# EAGLE design Phoenix_FC_shield (EAGLE 6.4)
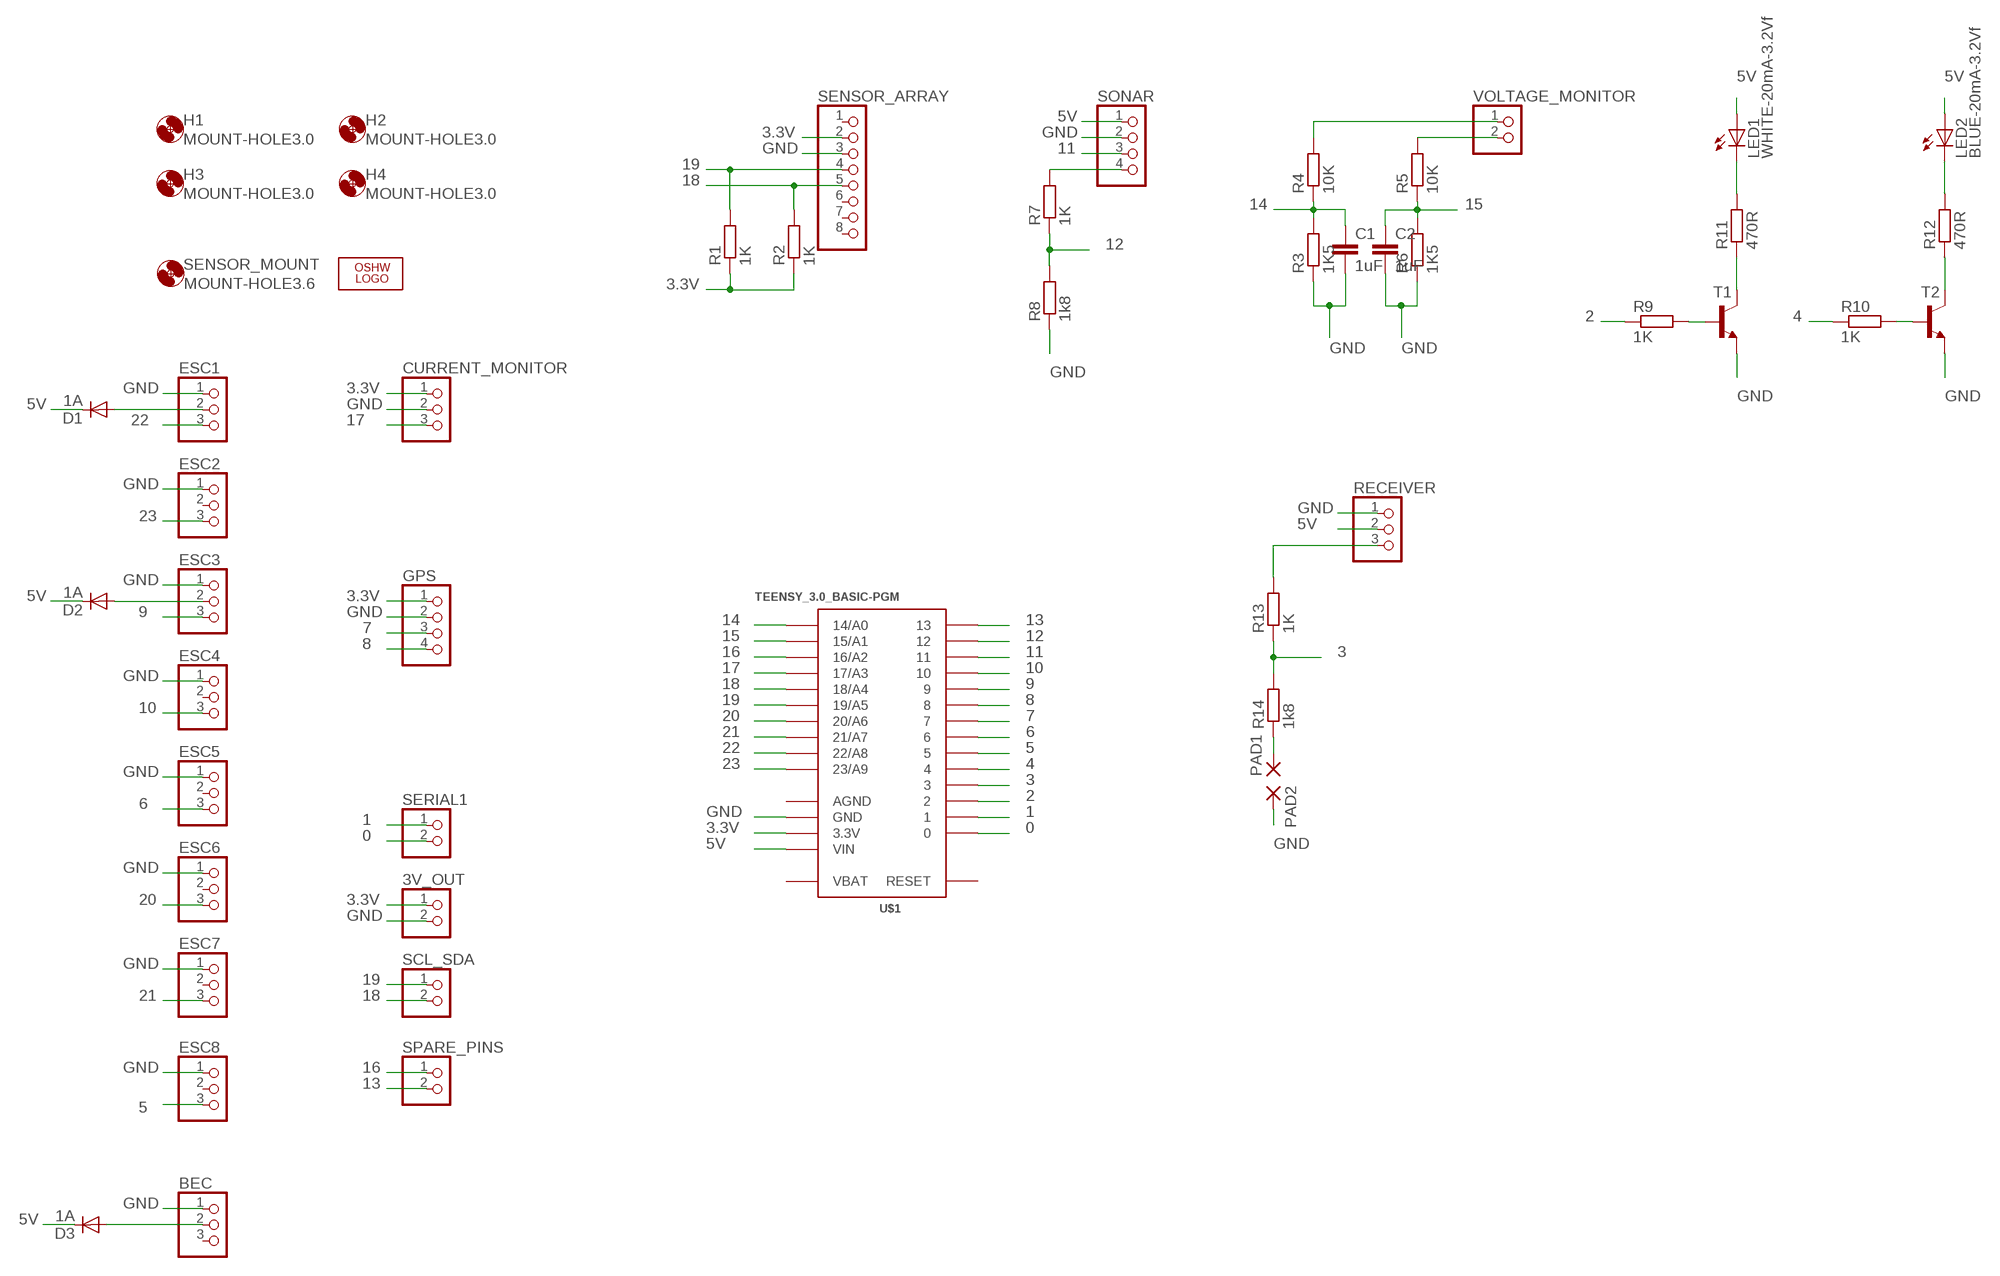
[diagram p0: schematic, sheet 1]

## Parts
3V_OUT  PINHD-1X2  [1X02]
BEC  PINHD-1X3  [1X03]
C1  1uF  C-EUC0805  [C0805]
C2  1uF  C-EUC0805  [C0805]
CURRENT_MONITOR  PINHD-1X3  [1X03]
D1  1A  DIODE-DO-214AC  [DO-214AC]
D2  1A  DIODE-DO-214AC  [DO-214AC]
D3  1A  DIODE-DO-214AC  [DO-214AC]
ESC1  PINHD-1X3  [1X03]
ESC2  PINHD-1X3  [1X03]
ESC3  PINHD-1X3  [1X03]
ESC4  PINHD-1X3  [1X03]
ESC5  PINHD-1X3  [1X03]
ESC6  PINHD-1X3  [1X03]
ESC7  PINHD-1X3  [1X03]
ESC8  PINHD-1X3  [1X03]
GPS  PINHD-1X4  [1X04]
H1  MOUNT-HOLE3.0  [3,0]
H2  MOUNT-HOLE3.0  [3,0]
H3  MOUNT-HOLE3.0  [3,0]
H4  MOUNT-HOLE3.0  [3,0]
LED1  WHITE-20mA-3.2Vf  LEDCHIP-LED0805  [CHIP-LED0805]
LED2  BLUE-20mA-3.2Vf  LEDCHIP-LED0805  [CHIP-LED0805]
LOGO1  OSHW_LOGO_8MILX0200-NT  [OSHW_8X200_NOTEXT]
PAD1  WIREPADSMD1,27-254  [SMD1,27-2,54]
PAD2  WIREPADSMD1,27-254  [SMD1,27-2,54]
R1  1K  R-EU_R0805  [R0805]
R2  1K  R-EU_R0805  [R0805]
R3  1K5  R-EU_R0805  [R0805]
R4  10K  R-EU_R0805  [R0805]
R5  10K  R-EU_R0805  [R0805]
R6  1K5  R-EU_R0805  [R0805]
R7  1K  R-EU_R0805  [R0805]
R8  1k8  R-EU_R0805  [R0805]
R9  1K  R-EU_R0805  [R0805]
R10  1K  R-EU_R0805  [R0805]
R11  470R  R-EU_R0805  [R0805]
R12  470R  R-EU_R0805  [R0805]
R13  1K  R-EU_R0805  [R0805]
R14  1k8  R-EU_R0805  [R0805]
RECEIVER  PINHD-1X3  [1X03]
SCL_SDA  PINHD-1X2  [1X02]
SENSOR_ARRAY  PINHD-1X8  [1X08]
SENSOR_MOUNT  MOUNT-HOLE3.6  [3,6]
SERIAL1  PINHD-1X2  [1X02]
SONAR  PINHD-1X4  [1X04]
SPARE_PINS  PINHD-1X2  [1X02]
T1  BC817-40SMD  [SOT23-BEC]
T2  BC817-40SMD  [SOT23-BEC]
U$1  TEENSY_3.0_BASIC-PGM  [TEENSY_3.0_BASIC-PGM]
VOLTAGE_MONITOR  PINHD-1X2  [1X02]

## Nets
0: SERIAL1.2 U$1.0
1: SERIAL1.1 U$1.1
2: R9.1 U$1.2
3: R13.1 R14.2 U$1.3
3.3V: 3V_OUT.1 CURRENT_MONITOR.1 GPS.1 R1.1 R2.1 SENSOR_ARRAY.2 U$1.3.3V U$1.3.3V1(3.3V)
4: R10.1 U$1.4
5: ESC8.3 U$1.5
5V: D1.C D2.C D3.C LED1.A LED2.A RECEIVER.2 SONAR.1 U$1.VIN
6: ESC5.3 U$1.6
7: GPS.3 U$1.7
8: GPS.4 U$1.8
9: ESC3.3 U$1.9
10: ESC4.3 U$1.10
11: SONAR.3 U$1.11
12: R7.1 R8.2 U$1.12
13: SPARE_PINS.2 U$1.13
14: C1.1 R3.2 R4.1 U$1.14/A0
15: C2.1 R5.1 R6.2 U$1.15/A1
16: SPARE_PINS.1 U$1.16/A2
17: CURRENT_MONITOR.3 U$1.17/A3
18: R2.2 SCL_SDA.2 SENSOR_ARRAY.5 U$1.18/A4
19: R1.2 SCL_SDA.1 SENSOR_ARRAY.4 U$1.19/A5
20: ESC6.3 U$1.20/A6
21: ESC7.3 U$1.21/A7
22: ESC1.3 U$1.22/A8
23: ESC2.3 U$1.23/A9
GND: 3V_OUT.2 BEC.1 C1.2 C2.2 CURRENT_MONITOR.2 ESC1.1 ESC2.1 ESC3.1 ESC4.1 ESC5.1 ESC6.1 ESC7.1 ESC8.1 GPS.2 PAD2.1(P) R3.1 R6.1 R8.1 RECEIVER.1 SENSOR_ARRAY.3 SONAR.2 T1.E T2.E U$1.GND U$1.GND1(GND)
N$1: R5.2 VOLTAGE_MONITOR.2
N$2: R7.2 SONAR.4
N$3: R11.1 T1.C
N$4: R9.2 T1.B
N$5: D2.A ESC3.2
N$6: PAD1.1(P) R14.1
N$7: R4.2 VOLTAGE_MONITOR.1
N$8: R10.2 T2.B
N$9: R12.1 T2.C
N$10: LED1.C R11.2
N$11: LED2.C R12.2
N$12: D1.A ESC1.2
N$13: R13.2 RECEIVER.3
N$15: BEC.2 D3.A
Unconnected: BEC.3 ESC2.2 ESC4.2 ESC5.2 ESC6.2 ESC7.2 ESC8.2 SENSOR_ARRAY.1 SENSOR_ARRAY.6 SENSOR_ARRAY.7 SENSOR_ARRAY.8 U$1.RESET

## Power pins joined to a net without a drawn wire
AGND: U$1.AGND
VBAT: U$1.VBAT

## Library data of the parts
3V_OUT SCL_SDA SERIAL1 SPARE_PINS VOLTAGE_MONITOR = pinhead:PINHD-1X2: PIN HEADER
BEC CURRENT_MONITOR ESC1-ESC8 RECEIVER = pinhead:PINHD-1X3: PIN HEADER
C1 C2 = rcl:C-EU: CAPACITOR, European symbol
D1-D3 = diode:DIODE-: DIODE
GPS SONAR = pinhead:PINHD-1X4: PIN HEADER
H1-H4 SENSOR_MOUNT = holes:MOUNT-HOLE: MOUNTING HOLE with drill center marker
LED1 LED2 = led:LED: LED OSRAM: - CHIPLED LG R971, LG N971, LY N971, LG Q971, LY Q971, LO R971, LY R971 LH N974, LH R974 LS Q976, LO Q976, LY Q976 LO Q996 - Hyper CHIPLED LW Q18S LB Q993, LB Q99A, LB R99A - SideLED LS A670, LO A670, LY A670, LG A670, LP A670 LB A673, LV A673, LT A673, LW A673 LH A674 LY A675 LS A676, LA A676, LO A676, LY A676, LW A676 LS A679, LY A679, LG A679 - Hyper Micro SIDELED® LS Y876, LA Y876, LO Y876, LY Y876 LT Y87S - SmartLED LW L88C, LW L88S LB L89C, LB L89S, LG L890 LS L89K, LO L89K, LY L89K LS L896, LA L896, LO L896, LY L896 - TOPLED LS T670, LO T670, LY T670, LG T670, LP T670 LSG T670, LSP T670, LSY T670, LOP T670, LYG T670 LG T671, LOG T671, LSG T671 LB T673, LV T673, LT T673, LW T673 LH T674 LS T676, LA T676, LO T676, LY T676, LB T676, LH T676, LSB T676, LW T676 LB T67C, LV T67C, LT T67C, LS T67K, LO T67K, LY T67K, LW E67C LS E67B, LA E67B, LO E67B, LY E67B, LB E67C, LV E67C, LT E67C LW T67C LS T679, LY T679, LG T679 LS T770, LO T770, LY T770, LG T770, LP T770 LB T773, LV T773, LT T773, LW T773 LH T774 LS E675, LA E675, LY E675, LS T675 LS T776, LA T776, LO T776, LY T776, LB T776 LHGB T686 LT T68C, LB T68C - Hyper Mini TOPLED® LB M676 - Mini TOPLED Santana® LG M470 LS M47K, LO M47K, LY M47K Source: http://www.osram.convergy.de LUXEON: - LUMILED® LXK2-PW12-R00, LXK2-PW12-S00, LXK2-PW14-U00, LXK2-PW14-V00 LXK2-PM12-R00, LXK2-PM12-S00, LXK2-PM14-U00 LXK2-PE12-Q00, LXK2-PE12-R00, LXK2-PE12-S00, LXK2-PE14-T00, LXK2-PE14-U00 LXK2-PB12-K00, LXK2-PB12-L00, LXK2-PB12-M00, LXK2-PB14-N00, LXK2-PB14-P00, LXK2-PB14-Q00 LXK2-PR12-L00, LXK2-PR12-M00, LXK2-PR14-Q00, LXK2-PR14-R00 LXK2-PD12-Q00, LXK2-PD12-R00, LXK2-PD12-S00 LXK2-PH12-R00, LXK2-PH12-S00 LXK2-PL12-P00, LXK2-PL12-Q00, LXK2-PL12-R00 Source: www.luxeon.com KINGBRIGHT: KA-3528ASYC Source: www.kingbright.com
LOGO1 = ohw-logo:OSHW_LOGO_8MIL
PAD1 PAD2 = wirepad:WIREPAD: Wire PAD connect wire on PCB
R1-R14 = resistor:R-EU_: RESISTOR, European symbol
SENSOR_ARRAY = pinhead:PINHD-1X8: PIN HEADER
T1 T2 = transistor-npn:BC817*: NPN Transistor
U$1 = Teensy3.0:TEENSY_3.0_BASIC-PGM: Teensy 3.0 Board outline identical to other 'basic' version except that 'PGM' pin has been omitted. See '+4', 'AllAnalogPins", and 'AllPins' packages for additional pin holes, as needed.

## Board
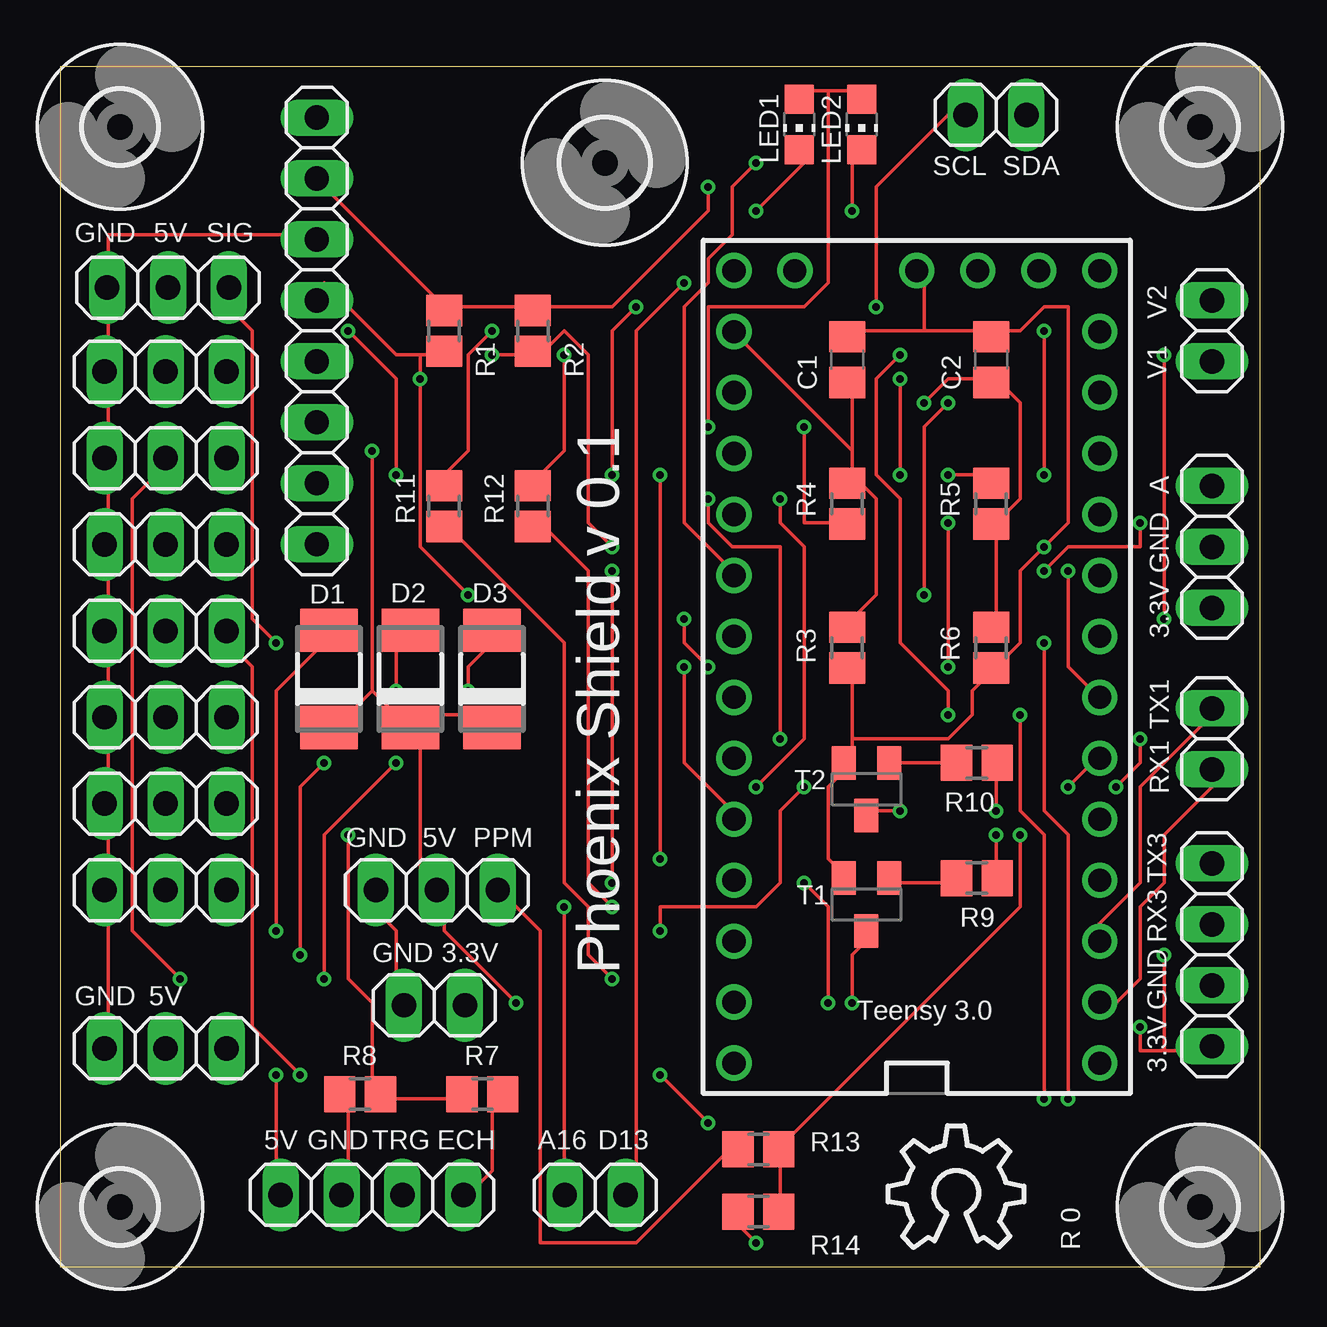
[diagram p1: board, top side]
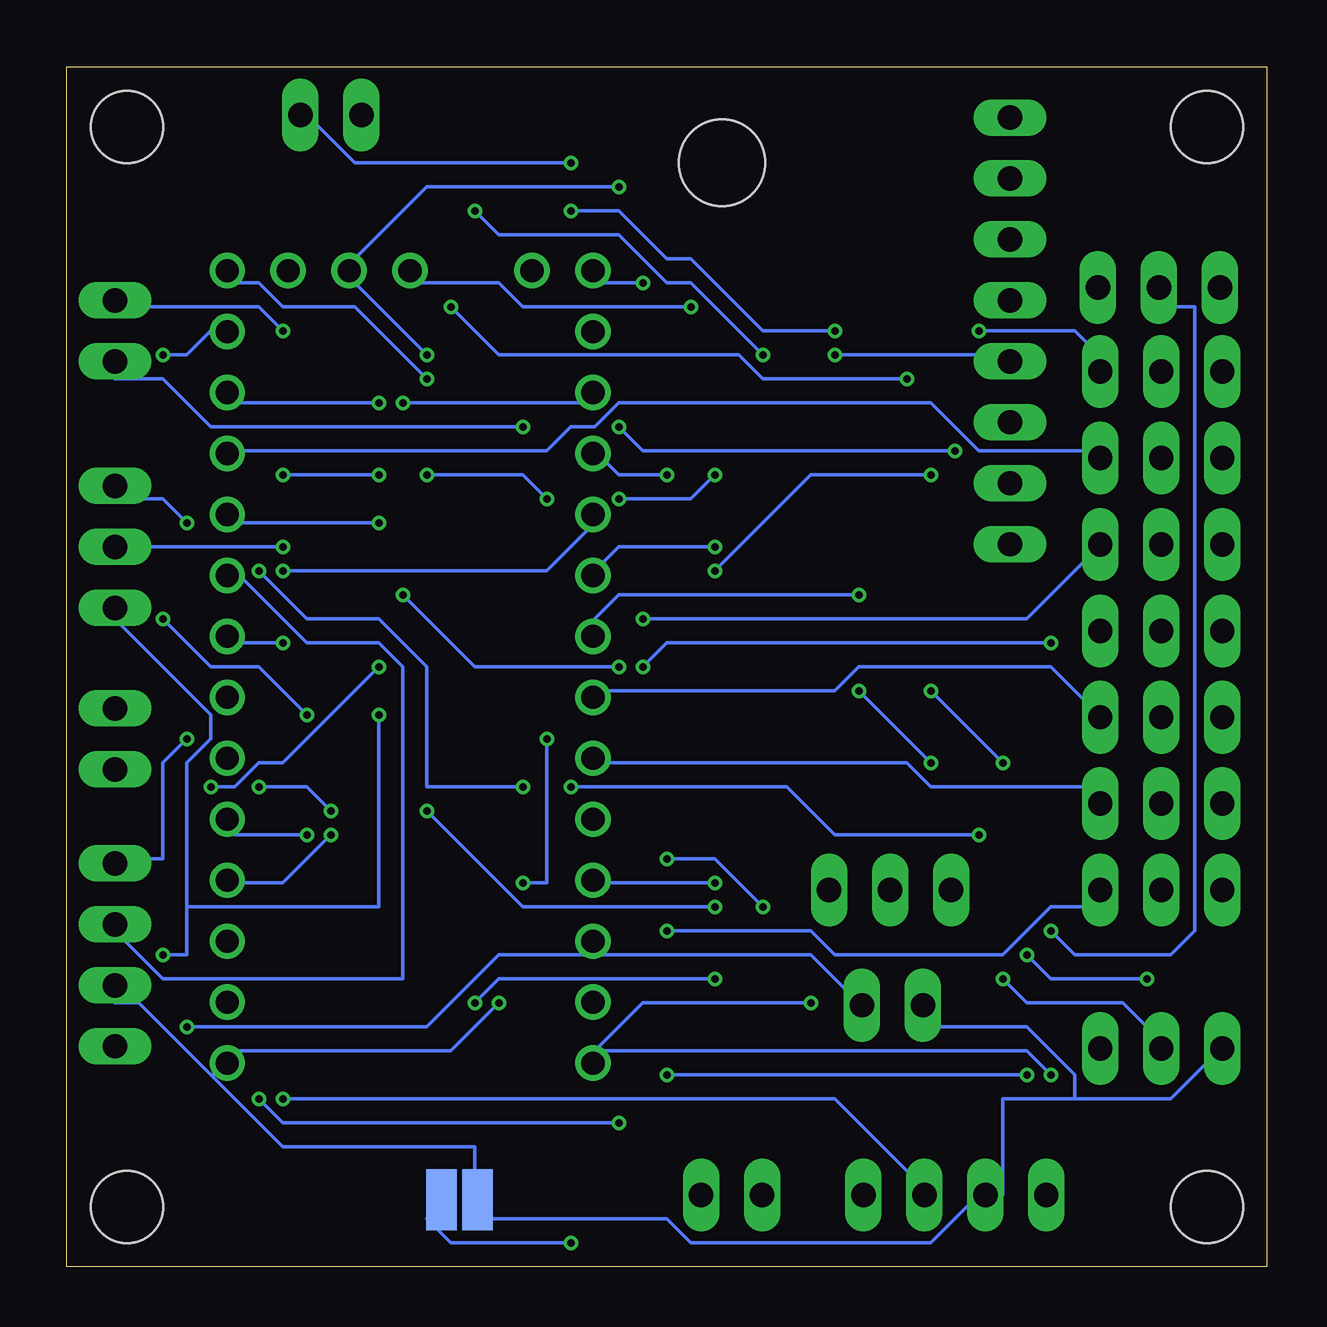
[diagram p2: board, bottom side, seen from below]

Size 50 x 50 mm. Coordinates in mm from the lower left corner, seen from the top.
Outline: 0,0 50,0 50,50 0,50 0,0
Copper layers (1*16): Top 0.035mm / dielectric 1.5mm / Bottom 0.035mm
Design rules "ITEADstudio_DRC": minimum track width 6mil, minimum drill 12mil, track to track 6mil, track to pad 6mil, pad to pad 6mil, via to via 6mil, smd to smd 0mil, copper to edge 10mil, drill to drill 10mil, minimum pad ring 10mil, minimum via ring 6mil, stop-mask expansion 2mil, vias tented up to drill 100mil, thermal gap 10mil

### Footprints (pad centres in the part's own frame; a part is rotated, then mirrored left to right if it is on the bottom)
1X02 = drill 1.016 long: 1 -1.27,0; 2 1.27,0
1X03 = drill 1.016 long: 1 -2.54,0; 2 0,0; 3 2.54,0
C0805 = smd 1.3 x 1.5: 1 -0.95,0; 2 0.95,0
DO-214AC = smd 1.8 x 2.4: A 2.025,0; C -2.025,0
1X04 = drill 1.016 long: 1 -3.81,0; 2 -1.27,0; 3 1.27,0; 4 3.81,0
3,0 = hole 3: 0,0
CHIP-LED0805 = smd 1.2 x 1.2: A 0,-1.05; C 0,1.05
SMD1,27-2,54 = smd 1.27 x 2.54: 1 0,0
R0805 = smd 1.3 x 1.5: 1 -0.85,0; 2 0.85,0
1X08 = drill 1.016 long: 1 -8.89,0; 2 -6.35,0; 3 -3.81,0; 4 -1.27,0; 5 1.27,0; 6 3.81,0; 7 6.35,0; 8 8.89,0
3,6 = hole 3.6: 0,0
SOT23-BEC = smd 1 x 1.4: B -0.95,-1.1; C 0,1.1; E 0.95,-1.1
TEENSY_3.0_BASIC-PGM = drill 0.965: 0 -7.62,13.97; 1 -7.62,11.43; 2 -7.62,8.89; 3 -7.62,6.35; 3.3V 7.62,11.43; 3.3V1 -2.54,-16.51; 4 -7.62,3.81; 5 -7.62,1.27; 6 -7.62,-1.27; 7 -7.62,-3.81; 8 -7.62,-6.35; 9 -7.62,-8.89; 10 -7.62,-11.43; 11 -7.62,-13.97; 12 -7.62,-16.51; 13 7.62,-16.51; 14/A0 7.62,-13.97; 15/A1 7.62,-11.43; 16/A2 7.62,-8.89; 17/A3 7.62,-6.35; 18/A4 7.62,-3.81; 19/A5 7.62,-1.27; 20/A6 7.62,1.27; 21/A7 7.62,3.81; 22/A8 7.62,6.35; 23/A9 7.62,8.89; AGND 7.62,13.97; GND -7.62,16.51; GND1 0,-16.51; RESET 5.08,-16.51; VBAT -5.08,-16.51; VIN 7.62,16.51

### Placement (x,y rotation side)
3V_OUT  15.6,10.9 180 top
BEC  4.4,9.1 0 top
C1  32.8,37.8 90 top
C2  38.8,37.8 90 top
CURRENT_MONITOR  48,30 90 top
D1  11.2,24.5 90 top
D2  14.6,24.5 90 top
D3  18,24.5 90 top
ESC1  4.5,40.8 0 top
ESC2  4.4,37.3 0 top
ESC3  4.4,33.7 0 top
ESC4  4.4,30.1 0 top
ESC5  4.4,26.5 0 top
ESC6  4.4,22.9 0 top
ESC7  4.4,19.3 0 top
ESC8  4.4,15.7 0 top
GPS  48,13 90 top
H1  47.5,47.5 0 top
H2  47.5,2.5 0 top
H3  2.5,47.5 0 top
H4  2.5,2.5 0 top
LED1  30.8,47.6 180 top
LED2  33.4,47.6 180 top
LOGO1  34.5,0.8 0 top
PAD1  34.4,2.8 0 bottom
PAD2  32.9,2.8 0 bottom
R1  16,39 270 top
R2  19.7,39 270 top
R3  32.8,25.8 90 top
R4  32.8,31.8 270 top
R5  38.8,31.8 90 top
R6  38.8,25.8 90 top
R7  17.6,7.2 0 top
R8  12.5,7.2 0 top
R9  38.2,16.2 180 top
R10  38.2,21 180 top
R11  16,31.7 90 top
R12  19.7,31.7 90 top
R13  29.1,4.9 180 top
R14  29.1,2.3 0 top
RECEIVER  15.7,15.7 0 top
SCL_SDA  39,48 0 top
SENSOR_ARRAY  10.7,39 270 top
SENSOR_MOUNT  22.7,46 0 top
SERIAL1  48,22 270 top
SONAR  13,3 0 top
SPARE_PINS  22.3,3 0 top
T1  33.6,15.1 180 top
T2  33.6,19.9 180 top
U$1  35.7,25 180 top
VOLTAGE_MONITOR  48,39 90 top

### Tracks (layer width: path | path; a pad name or v marks a point on that pad's centre or on a via)
0
  Top 0.152: U$1.0 44,11 45,12 45,15 46,16 46,18 48,20 SERIAL1.2
1
  Top 0.152: U$1.1 43,14 45,16 45,20 48,23 SERIAL1.1
2  (via drill 0.3)
  Top 0.152: v39,18 39,16 R9.1
  Bottom 0.152: v39,18 41,16 43,16 U$1.2
3  (via drill 0.3)
  Top 0.152: 30,5 30,3 R14.2 | 30,5 40,15 v40,18 | 30,5 R13.1
  Bottom 0.152: v40,18 43,18 U$1.3
3.3V  (via drill 0.3)
  Top 0.152: 38,42 U$1.3.3V1 | 16,40 19,40 R2.1 20,40 23,40 27,44 v27,45 | 16,40 11,45 SENSOR_ARRAY.2 | 16,40 R1.1 | 28,14 U$1.3.3V | 46,9 45,9 v45,10 | 46,9 48,9 GPS.1 | 46,9 v46,13 | v35,38 34,37 34,33 35,32 35,26 37,24 v37,23
  Bottom 0.152: v27,45 35,45 38,42 U$1.3.3V1 38,41 v35,38 | 28,13 19,13 17,11 3V_OUT.1 | v45,10 35,10 32,13 28,13 | 28,13 U$1.3.3V | 45,15 45,13 v46,13 | 45,15 45,21 44,22 44,23 48,27 CURRENT_MONITOR.1 | v37,23 37,15 45,15
4  (via drill 0.3)
  Top 0.152: v39,19 39,21 R10.1 | v42,20 43,21 U$1.4
  Bottom 0.152: v39,19 40,20 v42,20
5  (via drill 0.3)
  Top 0.152: v42,29 42,25 43,24 U$1.5 | v31,20 30,19 30,16 29,15 25,15 v25,14
  Bottom 0.152: v42,29 40,27 37,27 35,25 35,20 v31,20 | v25,14 19,14 18,13 11,13 9,15 7,15 ESC8.3
5V  (via drill 0.3)
  Top 0.152: v19,11 16,14 16,15 RECEIVER.2 15,16 15,22 D2.C | v9,8 9,3 SONAR.1 | 32,49 33,49 LED2.A | 32,49 31,49 LED1.A | 32,49 32,41 31,40 27,40 v27,35 | 13,24 v13,34 | 13,24 12,23 D1.C | 13,24 14,23 D2.C | D3.C 18,23 15,23 D2.C
  Bottom 0.152: 28,9 26,11 v19,11 | v9,8 10,9 28,9 | 28,9 U$1.VIN | v27,35 26,34 v13,34
6  (via drill 0.3)
  Top 0.152: v41,26 41,19 42,18 v42,7 | v25,8 v27,6 | v10,8 8,10 8,25 7,26 ESC5.3
  Bottom 0.152: v41,26 43,26 U$1.6 | v42,7 41,6 v27,6 | v10,8 v25,8
7
  Bottom 0.152: U$1.7 43,29 40,26 37,26 36,25 36,12 46,12 48,14 GPS.3
8  (via drill 0.3)
  Top 0.152: v37,25 v37,31 | v44,20 45,21 v45,22
  Bottom 0.152: v37,31 43,31 U$1.8 | v37,25 41,21 42,21 43,20 v44,20 | v45,22 46,21 46,17 48,17 GPS.4
9
  Bottom 0.152: U$1.9 43,34 30,34 29,35 28,35 27,36 14,36 12,34 7,34 ESC3.3
10  (via drill 0.3)
  Top 0.152: v37,36 36,35 v36,28 | v27,25 26,26 v26,27
  Bottom 0.152: v37,36 43,36 U$1.10 | v36,28 33,25 v27,25 | v26,27 10,27 7,30 ESC4.3
11  (via drill 0.3)
  Top 0.152: v46,27 v46,38 | v40,23 40,19 41,18 v41,7
  Bottom 0.152: v46,38 45,38 44,39 U$1.11 | v46,27 44,25 42,25 v40,23 | v41,7 18,7 14,3 SONAR.3
12  (via drill 0.3)
  Top 0.152: 13,7 17,7 R7.1 | 13,7 13,11 12,12 v12,18 | v29,20 31,22 31,30 30,31 v30,32 | v35,37 v35,33 | 13,7 R8.2
  Bottom 0.152: v12,18 18,18 20,20 v29,20 | v30,32 31,33 v35,33 | v35,37 38,40 41,40 42,41 43,41 U$1.12
13  (via drill 0.3)
  Top 0.152: v26,41 24,39 24,3 SPARE_PINS.2
  Bottom 0.152: v26,41 28,41 U$1.13
14
  Top 0.152: 33,33 34,32 34,28 33,27 R3.2 | 33,33 33,34 | 33,34 33,37 C1.1 | 33,33 R4.1 | 33,34 28,39 U$1.14/A0
15  (via drill 0.3)
  Top 0.152: 39,31 39,27 R6.2 | 39,37 40,36 40,32 39,31 | 39,31 R5.1 | v36,36 37,37 39,37 | 39,37 C2.1
  Bottom 0.152: v36,36 28,36 U$1.15/A1
16  (via drill 0.3)
  Top 0.152: v25,17 v25,33 | v21,15 21,3 SPARE_PINS.1
  Bottom 0.152: v25,33 27,33 28,34 U$1.16/A2 | v25,17 23,17 v21,15
17  (via drill 0.3)
  Top 0.152: v41,29 42,30 45,30 v45,31
  Bottom 0.152: v41,29 30,29 28,31 U$1.17/A3 | v45,31 46,32 48,32 CURRENT_MONITOR.3
18  (via drill 0.3)
  Top 0.152: v18,38 19,38 R2.2 20,38 21,39 22,38 22,31 v23,30 | v29,46 28,45 28,43 27,42 27,41 26,40 26,31 28,29 U$1.18/A4
  Bottom 0.152: v18,38 11,38 SENSOR_ARRAY.5 | v23,30 27,30 28,29 U$1.18/A4 | v29,46 38,46 40,48 SCL_SDA.2
19  (via drill 0.3)
  Top 0.152: 15,38 14,38 11,41 SENSOR_ARRAY.4 | 15,38 16,38 R1.2 | v17,28 15,30 v15,37 15,38 | v34,40 34,45 37,48 SCL_SDA.1
  Bottom 0.152: v17,28 27,28 28,27 U$1.19/A5 | v34,40 32,38 22,38 21,37 v15,37
20
  Bottom 0.152: U$1.20/A6 28,24 18,24 17,25 9,25 7,23 ESC6.3
21
  Bottom 0.152: U$1.21/A7 28,21 15,21 14,20 7,20 ESC7.3
22  (via drill 0.3)
  Top 0.152: v26,25 26,21 28,19 U$1.22/A8 | v9,26 8,27 8,39 7,40 ESC1.3
  Bottom 0.152: v26,25 25,26 v9,26
23  (via drill 0.3)
  Top 0.152: v23,29 v23,16 | v14,33 14,37 v12,39
  Bottom 0.152: v23,16 28,16 U$1.23/A9 | v23,29 19,33 v14,33 | v12,39 8,39 7,38 ESC2.3
GND  (via drill 0.3)
  Top 0.152: 36,39 33,39 C1.2 | 36,39 36,41 U$1.GND1 36,42 | 36,39 39,39 | 33,21 32,20 32,17 33,16 T1.E | 33,21 33,22 | 33,22 33,25 R3.1 | 33,21 T2.E | 39,25 38,24 38,23 37,22 33,22 | 39,25 40,26 40,29 v41,30 42,31 42,40 41,40 40,39 39,39 | 39,25 R6.1 | 39,39 C2.2 | SENSOR_ARRAY.3 10,43 2,43 2,41 ESC1.1 2,40 2,38 ESC2.1 2,37 2,34 ESC3.1 2,33 2,31 ESC4.1 2,30 2,27 ESC5.1 2,26 2,23 ESC6.1 2,22 2,20 ESC7.1 2,19 2,16 ESC8.1 2,15 2,10 BEC.1 | 43,9 U$1.GND | RECEIVER.1 13,15 14,14 14,11 3V_OUT.2 | R8.1 12,7 12,3 SONAR.2 | v24,40 23,39 v23,33 | v27,32 27,31 28,30 30,30 v30,22 | v31,16 32,15 v32,11
  Bottom 0.152: v41,30 CURRENT_MONITOR.2 | 44,8 47,11 48,11 GPS.2 | 44,8 41,5 33,5 33,3 PAD2.1 33,2 25,2 24,1 14,1 12,3 SONAR.2 11,3 11,7 8,7 | 44,8 43,8 U$1.GND 43,9 34,9 v32,11 | 8,7 4,7 2,9 BEC.1 | 8,7 8,8 10,10 14,10 3V_OUT.2 | v24,40 31,40 32,41 36,41 U$1.GND1 | v23,33 24,32 v27,32 | v30,22 30,16 v31,16
N$1  (via drill 0.3)
  Top 0.152: v37,33 39,33 R5.2 | v41,39 v41,33
  Bottom 0.152: v41,33 v37,33 | v41,39 42,40 48,40 VOLTAGE_MONITOR.2
N$2
  Top 0.152: R7.2 18,7 18,4 17,3 SONAR.4
N$3  (via drill 0.3)
  Top 0.152: v33,11 33,13 34,14 T1.C | v23,12 22,13 22,15 21,16 21,26 16,31 R11.1
  Bottom 0.152: v33,11 32,12 v23,12
N$4
  Top 0.152: T1.B 35,16 37,16 R9.2
N$5  (via drill 0.3)
  Top 0.152: v14,24 14,26 D2.A | v11,21 10,20 v10,13 | v5,12 3,14 3,32 4,33 ESC3.2
  Bottom 0.152: v11,21 v14,24 | v10,13 9,12 v5,12
N$6  (via drill 0.3)
  Top 0.152: v29,1 28,2 R14.1
  Bottom 0.152: v29,1 34,1 35,2 PAD1.1
N$7  (via drill 0.3)
  Top 0.152: v31,35 31,31 33,31 R4.2
  Bottom 0.152: v31,35 44,35 46,37 48,37 VOLTAGE_MONITOR.1
N$8
  Top 0.152: R10.2 T2.B
N$9  (via drill 0.3)
  Top 0.152: v35,19 34,19 T2.C | v23,15 22,16 22,29 20,31 R12.1
  Bottom 0.152: v35,19 31,15 v23,15
N$10  (via drill 0.3)
  Top 0.152: v29,44 31,46 LED1.C | v18,39 17,38 17,34 16,33 R11.2
  Bottom 0.152: v29,44 27,44 25,42 24,42 21,39 v18,39
N$11  (via drill 0.3)
  Top 0.152: v33,44 33,46 LED2.C | v21,38 21,34 20,33 R12.2
  Bottom 0.152: v33,44 32,43 27,43 25,41 24,41 v21,38
N$12  (via drill 0.3)
  Top 0.152: v9,14 9,24 11,26 D1.A
  Bottom 0.152: v9,14 8,13 4,13 3,14 3,40 4,40 ESC1.2
N$13
  Top 0.152: R13.2 28,5 24,1 20,1 20,14 19,15 RECEIVER.3
N$15  (via drill 0.3)
  Top 0.152: v17,24 17,25 18,26 D3.A | v14,21 11,18 v11,12
  Bottom 0.152: v14,21 v17,24 | v11,12 10,11 6,11 5,10 BEC.2

### Text on the board
tNames: SCL | SDA | GND | 5V | SIG | V2 | V1 | A | GND | 3.3V | TX1 | RX1 | GND | 5V | PPM | TX3 | RX3 | GND | 3.3V | Phoenix Shield v 0.1 | GND | 5V | GND | Teensy 3.0 | 3.3V | 5V | GND | TRG | ECH | A16 | D13 | R 0